# Altium schematic sheet GYROSCOPE.SchDoc
size A4
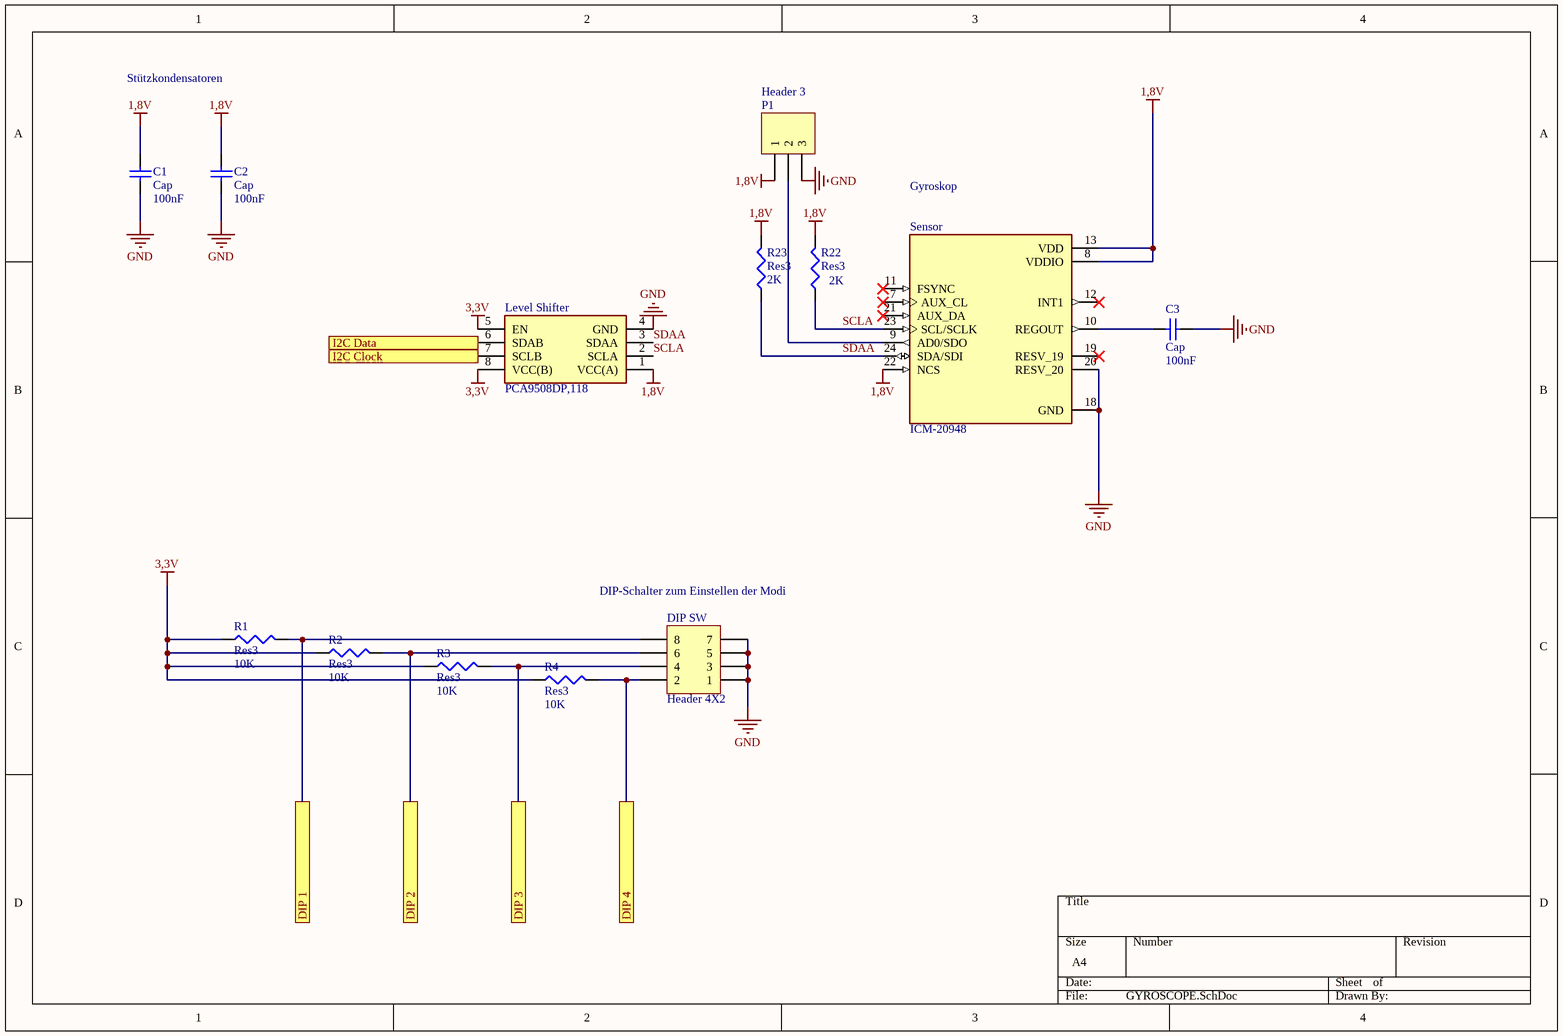
[diagram p0: GYROSCOPE.SchDoc]

## Parts
C1  Cap  value 100nF  [1608[0603]]
C2  Cap  value 100nF  [1608[0603]]
C3  Cap  value 100nF  [1608[0603]]
DIP_SW  Header 4X2  [HDR2X4]
Level_Shifter  PCA9508DP,118  [SOP65P490X110-8N]
P1  Header 3  [HDR1X3]
R1  Res3  value 10K  [J1-0603]
R2  Res3  value 10K  [J1-0603]
R3  Res3  value 10K  [J1-0603]
R4  Res3  value 10K  [J1-0603]
R22  Res3  value 2K  [J1-0603]
R23  Res3  value 2K  [J1-0603]
Sensor  ICM-20948  [QFN40P300X300X105-24N]

## Ports
DIP 1, DIP 2, DIP 3, DIP 4, I2C Clock, I2C Data

## Nets
1,8V: C1.2 C2.1 Level_Shifter.1(VCC(A)) P1.1 R22.2 R23.2 Sensor.8(VDDIO) Sensor.13(VDD) Sensor.22(NCS)
3,3V: Level_Shifter.5(EN) Level_Shifter.8(VCC(B)) R1.1 R2.1 R3.1 R4.1
GND: C1.1 C2.2 C3.2 DIP_SW.1 DIP_SW.3 DIP_SW.5 DIP_SW.7 Level_Shifter.4(GND) P1.3 Sensor.18(GND) Sensor.20(RESV_20)
DIP 1: DIP_SW.8 R1.2 ; port DIP 1
DIP 2: DIP_SW.6 R2.2 ; port DIP 2
DIP 3: DIP_SW.4 R3.2 ; port DIP 3
DIP 4: DIP_SW.2 R4.2 ; port DIP 4
I2C Clock: Level_Shifter.7(SCLB) ; port I2C Clock
I2C Data: Level_Shifter.6(SDAB) ; port I2C Data
SCLA: Level_Shifter.2(SCLA) R22.1 Sensor.23(SCL/SCLK)
SDAA: Level_Shifter.3(SDAA) R23.1 Sensor.24(SDA/SDI)
NetC3_1: C3.1 Sensor.10(REGOUT)
NetP1_2: P1.2 Sensor.9(AD0/SDO)

Not connected (* = marked no-connect by the designer): Sensor 7(AUX_CL)* 11(FSYNC)* 12(INT1)* 19(RESV_19)* 21(AUX_DA)*

## Notes on the sheet
- Stützkondensatoren
- Gyroskop
- (near DIP_SW) DIP-Schalter zum Einstellen der Modi

## Library data of the parts
C1-C3 = Cap: Capacitor; Published: 8-Jun-2000; LatestRevisionDate: 17-Jul-2002; LatestRevisionNote: Re-released for DXP Platform.; PackageReference: RAD-0.3; Publisher: Altium Limited; PackageDescription: Radial Cap, Thru-Hole; 2 Leads; 0.3 in Pin Spacing
DIP_SW = Header 4X2: Header, 4-Pin, Dual row; LatestRevisionDate: 17-Jul-2002; LatestRevisionNote: Re-released for DXP Platform.; Publisher: Altium Limited
Level_Shifter = PCA9508DP,118: Integrated Circuit; Manufacturer_Name: NXP; Datasheet Link: http://www.nxp.com/docs/en/data-sheet/PCA9508.pdf; Height: 1.1mm; Manufacturer_Part_Number: PCA9508DP,118
P1 = Header 3: Header, 3-Pin; LatestRevisionDate: 17-Jul-2002; LatestRevisionNote: Re-released for DXP Platform.; Publisher: Altium Limited
R1-R4 R22 R23 = Res3: Resistor; Published: 8-Jun-2000; LatestRevisionDate: 29-May-2009; LatestRevisionNote: IPC-7351 Footprint Added.; PackageReference: J1-0603; Publisher: Altium Limited; PackageDescription: Chip Resistor
Sensor = ICM-20948: Accelerometer, Gyroscope, Magnetometer, 9 Axis Sensor IÂ²C, SPI Output; MF: TDK InvenSense; Package: TFQFN-24 TDK InvenSense; Availability: Unavailable; MP: ICM-20948; Value: *; SnapEDA_Link: https://www.snapeda.com/parts/ICM-20948/TDK%20InvenSense/view-part/4218863/?ref=snap; Price: None